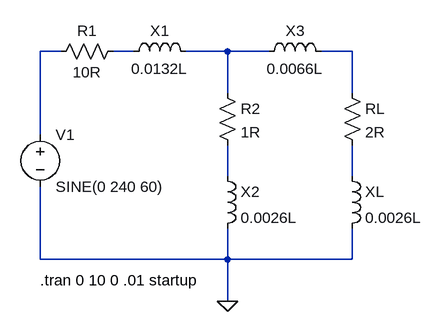
[diagram p0: schematic Project2.asc]
Project2.asc, the LTspice schematic file:
Version 4
SHEET 1 880 680
WIRE 192 80 160 80
WIRE 304 80 272 80
WIRE 448 80 384 80
WIRE 512 80 448 80
WIRE 640 80 592 80
WIRE 448 144 448 80
WIRE 640 144 640 80
WIRE 160 208 160 80
WIRE 448 272 448 224
WIRE 640 272 640 224
WIRE 160 400 160 288
WIRE 448 400 448 352
WIRE 448 400 160 400
WIRE 640 400 640 352
WIRE 640 400 448 400
WIRE 448 464 448 400
FLAG 448 464 0
SYMBOL res 288 64 R90
WINDOW 0 0 56 VBottom 2
WINDOW 3 32 56 VTop 2
SYMATTR InstName R1
SYMATTR Value 10R
SYMBOL res 432 128 R0
SYMATTR InstName R2
SYMATTR Value 1R
SYMBOL res 624 128 R0
SYMATTR InstName RL
SYMATTR Value 2R
SYMBOL ind 288 96 R270
WINDOW 0 32 56 VTop 2
WINDOW 3 5 56 VBottom 2
SYMATTR InstName X1
SYMATTR Value 0.0132L
SYMBOL ind 496 96 R270
WINDOW 0 32 56 VTop 2
WINDOW 3 5 56 VBottom 2
SYMATTR InstName X3
SYMATTR Value 0.0066L
SYMBOL ind 432 256 R0
SYMATTR InstName X2
SYMATTR Value 0.0026L
SYMBOL ind 624 256 R0
SYMATTR InstName XL
SYMATTR Value 0.0026L
SYMATTR SpiceLine Rser=1
SYMBOL voltage 160 192 R0
SYMATTR InstName V1
SYMATTR Value SINE(0 240 60)
TEXT 160 432 Left 2 !.tran 0 10 0 .01 startup

The netlist it stands for:
* Project2.asc
R1 N002 N001 10R
R2 N003 N005 1R
RL N004 N006 2R
L§X1 N002 N003 0.0132L
L§X3 N003 N004 0.0066L
L§X2 N005 0 0.0026L
L§XL N006 0 0.0026L Rser=1
V1 N001 0 SINE(0 240 60)
.tran 0 10 0 .01 startup
.backanno
.end